# EAGLE design SwiftV1 (EAGLE 6.1)
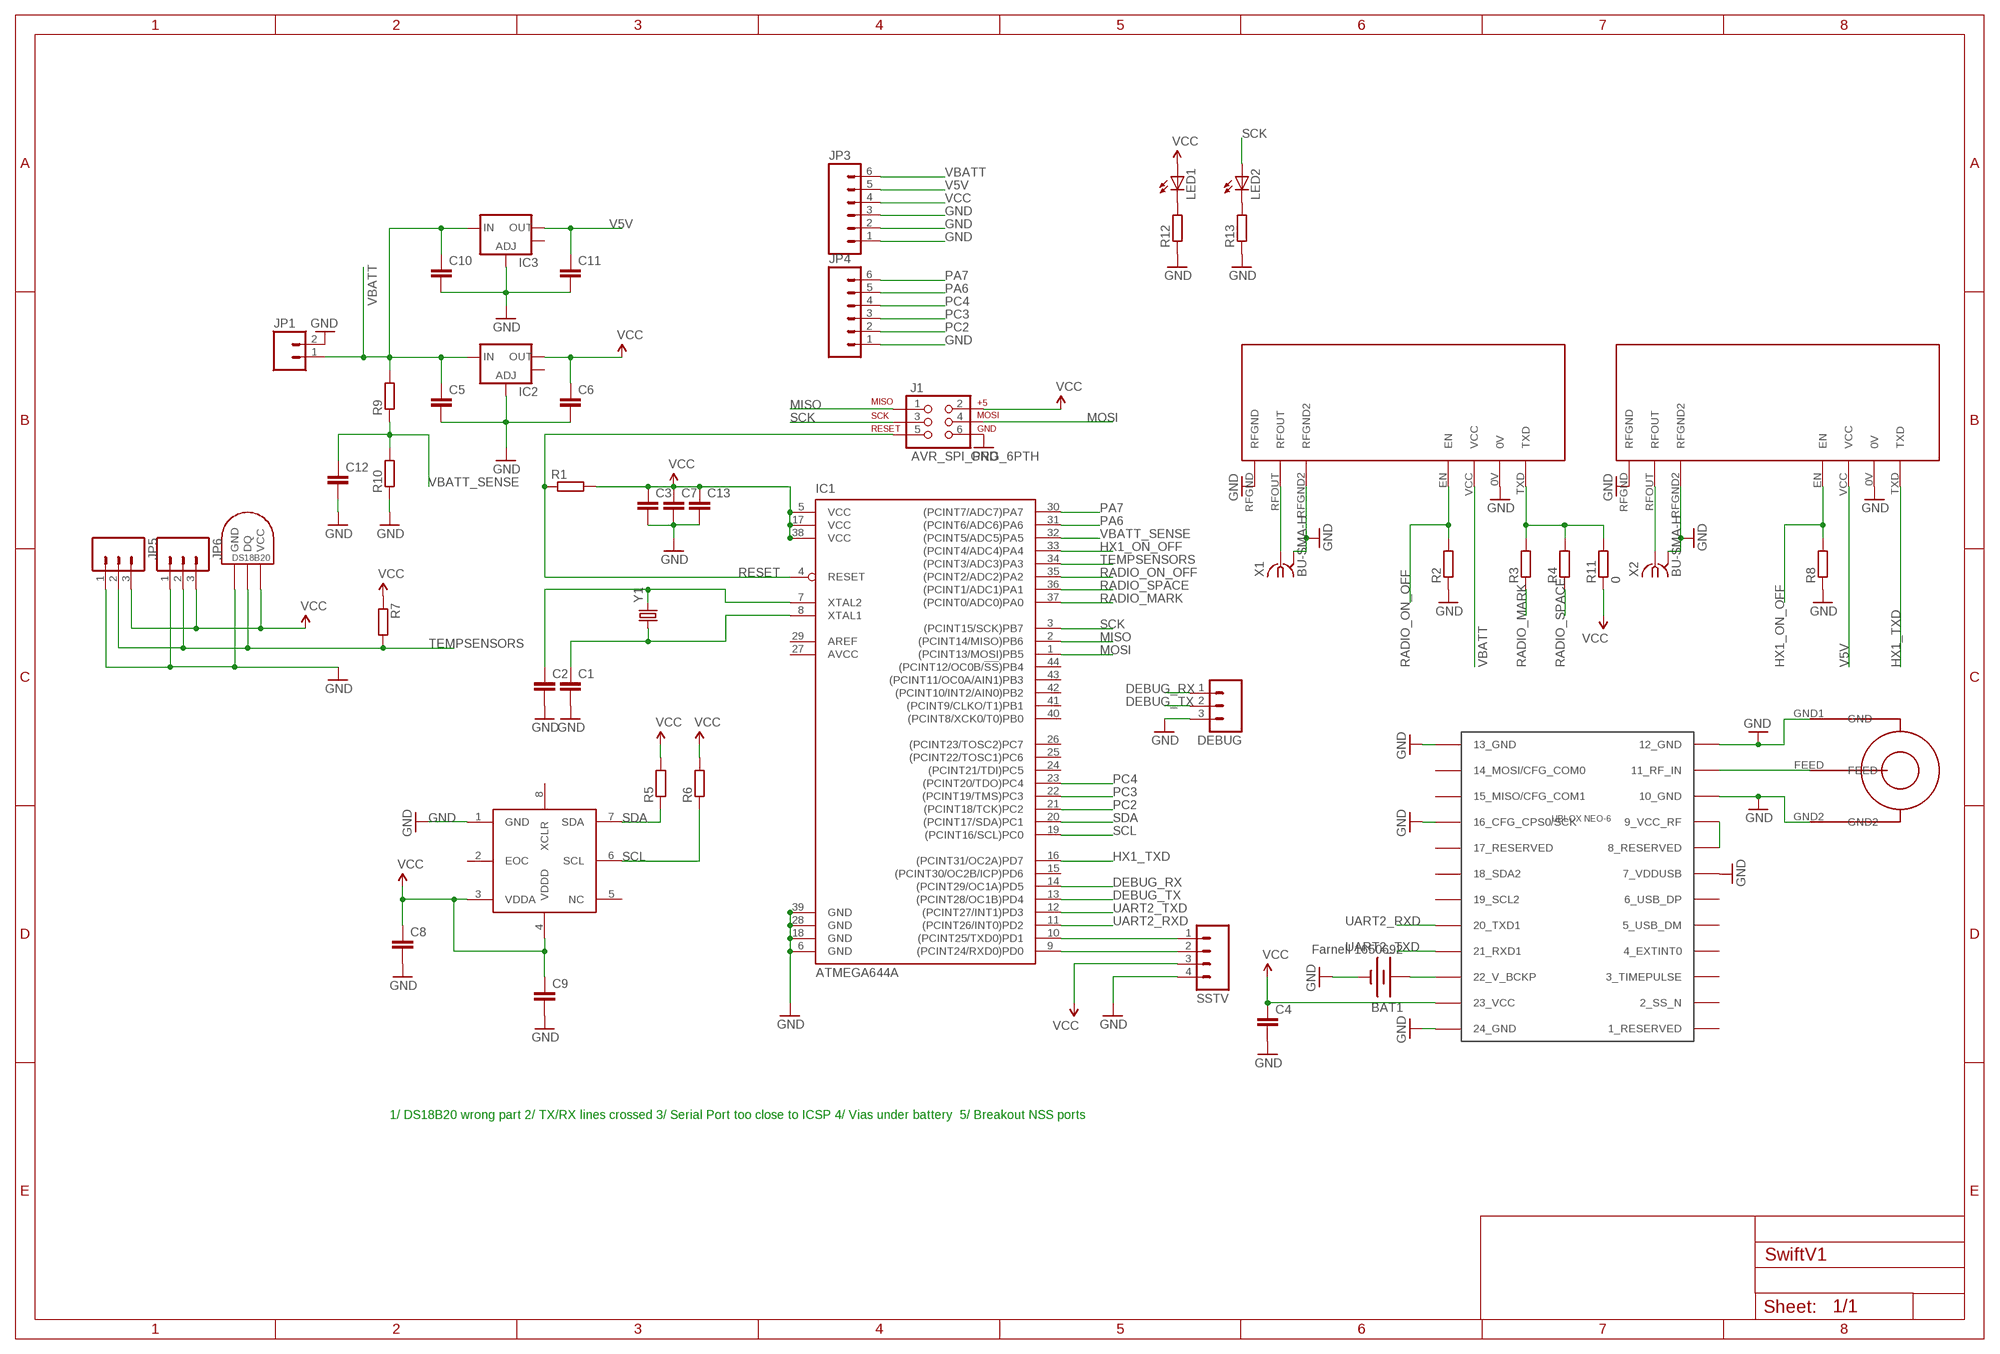
[diagram p0: schematic, sheet 1]

## Parts
BAT1  Farnell 1650692  BATTERY12MM  [BATTCON_12MM]
C1  C-EUC0805  [C0805]
C2  C-EUC0805  [C0805]
C3  C-EUC0805  [C0805]
C4  C-EUC0805  [C0805]
C5  C-EUC0805  [C0805]
C6  C-EUC0805  [C0805]
C7  C-EUC0805  [C0805]
C8  C-EUC0805  [C0805]
C9  C-EUC0805  [C0805]
C10  C-EUC0805  [C0805]
C11  C-EUC0805  [C0805]
C12  C-EUC0805  [C0805]
C13  C-EUC0805  [C0805]
DEBUG  M03PTH  [1X03]
IC1  ATMEGA644A  [TQFP44]
IC2  V_REG_LM1117SOT223  [SOT223]
IC3  V_REG_LM1117SOT223  [SOT223]
J1  AVR_SPI_PRG_6PTH  [2X3]
JP1  M02JST-PTH-2  [JST-2-PTH]
JP3  M06SIP  [1X06]
JP4  M06SIP  [1X06]
JP5  M03JST-PTH  [JST-3-PTH]
JP6  M03JST-PTH  [JST-3-PTH]
LED1  LED0603  [LED-0603]
LED2  LED0603  [LED-0603]
R1  R-EU_R0805  [R0805]
R2  R-EU_R0805  [R0805]
R3  R-EU_R0805  [R0805]
R4  R-EU_R0805  [R0805]
R5  R-EU_R0805  [R0805]
R6  R-EU_R0805  [R0805]
R7  R-EU_R0805  [R0805]
R8  R-EU_R0805  [R0805]
R9  R-EU_R0805  [R0805]
R10  R-EU_R0805  [R0805]
R11  0  R-EU_R0805  [R0805]
R12  R-EU_R0805  [R0805]
R13  R-EU_R0805  [R0805]
SSTV  M04PTH  [1X04]
TEMPINT  DS1821  DS1820SOIC  [DS18B20_SOIC]
U$1  BMP085  [BMP085]
U$2  NTX2  [NTX2]
U$3  SARANTEL-SR1202  [SARANTEL-SR1202]
U$4  UBLOX_NEO-6  [UBLOX_NEO-6P]
U$5  NTX2  [NTX2]
X1  BU-SMA-H  [BU-SMA-H]
X2  BU-SMA-H  [BU-SMA-H]
Y1  CRYSTALSMD  [HC49UP]

## Nets
DEBUG_RX: DEBUG.1 IC1.14((PCINT29/OC1A)PD5)
DEBUG_TX: DEBUG.2 IC1.13((PCINT28/OC1B)PD4)
GND: BAT1.GND(-) C1.2 C2.2 C3.2 C4.2 C5.2 C6.2 C7.2 C8.2 C9.2 C10.2 C11.2 C12.2 C13.2 DEBUG.3 IC1.6(GND) IC1.18(GND) IC1.28(GND) IC1.39(GND) IC2.1(ADJ) IC3.1(ADJ) J1.6 JP1.2 JP3.1 JP3.2 JP3.3 JP4.1 JP5.1 JP6.1 R2.1 R8.1 R10.1 R12.1 R13.1 SSTV.4 TEMPINT.GND U$1.1(GND) U$2.0V U$2.RFGND U$2.RFGND2 U$3.GND1(GND) U$3.GND2 U$4.7_VDDUSB U$4.10_GND U$4.12_GND U$4.13_GND U$4.16_CFG_CPS0/SCK U$4.24_GND U$5.0V U$5.RFGND U$5.RFGND2 X1.2(GND) X2.2(GND)
HX1_ON_OFF: IC1.33((PCINT4/ADC4)PA4) R8.2 U$5.EN
HX1_TXD: IC1.16((PCINT31/OC2A)PD7) U$5.TXD
MISO: IC1.2((PCINT14/MISO)PB6) J1.1
MOSI: IC1.1((PCINT13/MOSI)PB5) J1.4
N$1: C2.1 IC1.7(XTAL2) Y1.2
N$2: C1.1 IC1.8(XTAL1) Y1.1
N$4: U$2.RFOUT X1.1
N$5: BAT1.PWR@1(+) U$4.22_V_BCKP
N$7: LED1.C R12.2
N$8: U$5.RFOUT X2.1
N$9: U$3.FEED U$4.11_RF_IN
N$10: R3.2 R4.2 R11.2 U$2.TXD
N$11: U$4.8_RESERVED U$4.9_VCC_RF
N$14: LED2.C R13.2
PA6: IC1.31((PCINT6/ADC6)PA6) JP4.5
PA7: IC1.30((PCINT7/ADC7)PA7) JP4.6
PC2: IC1.21((PCINT18/TCK)PC2) JP4.2
PC3: IC1.22((PCINT19/TMS)PC3) JP4.3
PC4: IC1.23((PCINT20/TDO)PC4) JP4.4
RADIO_MARK: IC1.37((PCINT0/ADC0)PA0) R3.1
RADIO_ON_OFF: IC1.35((PCINT2/ADC2)PA2) R2.2 U$2.EN
RADIO_SPACE: IC1.36((PCINT1/ADC1)PA1) R4.1
RESET: IC1.4(RESET) J1.5 R1.1
RXD0: IC1.9((PCINT24/RXD0)PD0) SSTV.2
SCK: IC1.3((PCINT15/SCK)PB7) J1.3 LED2.A
SCL: IC1.19((PCINT16/SCL)PC0) R6.1 U$1.6(SCL)
SDA: IC1.20((PCINT17/SDA)PC1) R5.1 U$1.7(SDA)
TEMPSENSORS: IC1.34((PCINT3/ADC3)PA3) JP5.2 JP6.2 R7.2 TEMPINT.DQ
TXD0: IC1.10((PCINT25/TXD0)PD1) SSTV.1
UART2_RXD: IC1.11((PCINT26/INT0)PD2) U$4.20_TXD1
UART2_TXD: IC1.12((PCINT27/INT1)PD3) U$4.21_RXD1
V5V: C11.1 IC3.2(OUT) JP3.5 U$5.VCC
VBATT: C5.1 C10.1 IC2.3(IN) IC3.3(IN) JP1.1 JP3.6 R9.2 U$2.VCC
VBATT_SENSE: C12.1 IC1.32((PCINT5/ADC5)PA5) R9.1 R10.2
VCC: C3.1 C4.1 C6.1 C7.1 C8.1 C9.1 C13.1 IC1.5(VCC) IC1.17(VCC) IC1.38(VCC) IC2.2(OUT) J1.2 JP3.4 JP5.3 JP6.3 LED1.A R1.2 R5.2 R6.2 R7.1 R11.1 SSTV.3 TEMPINT.VCC U$1.3(VDDA) U$1.4(VDDD) U$4.23_VCC
Unconnected: IC1.15((PCINT30/OC2B/ICP)PD6) IC1.24((PCINT21/TDI)PC5) IC1.25((PCINT22/TOSC1)PC6) IC1.26((PCINT23/TOSC2)PC7) IC1.29(AREF) IC1.40((PCINT8/XCK0/T0)PB0) IC1.41((PCINT9/CLKO/T1)PB1) IC1.42((PCINT10/INT2/AIN0)PB2) IC1.43((PCINT11/OC0A/AIN1)PB3) IC1.44((PCINT12/OC0B/!SS!)PB4) IC2.4(OUT) IC3.4(OUT) U$1.2(EOC) U$1.5(NC) U$1.8(XCLR) U$4.1_RESERVED U$4.2_SS_N U$4.3_TIMEPULSE U$4.4_EXTINT0 U$4.5_USB_DM U$4.6_USB_DP U$4.14_MOSI/CFG_COM0 U$4.15_MISO/CFG_COM1 U$4.17_RESERVED U$4.18_SDA2 U$4.19_SCL2

## Notes on the sheet
- 1/ DS18B20 wrong part 2/ TX/RX lines crossed 3/ Serial Port too close to ICSP 4/ Vias under battery  5/ Breakout NSS ports

## Power pins joined to a net without a drawn wire
AVCC: IC1.27(AVCC)
GND: X1.3(GND) X1.4(GND) X1.5(GND) X2.3(GND) X2.4(GND) X2.5(GND)

## Library data of the parts
BAT1 = SparkFun:BATTERY: Battery Holders Various common sizes : AA, AAA, 20mm coin cell and 12mm coin cell.
C1-C13 = resistor:C-EU: CAPACITOR, European symbol
DEBUG JP5 JP6 = SparkFun:M03: Header 3 Standard 3-pin 0.1" header. Use with straight break away headers (SKU : PRT-00116), right angle break away headers (PRT-00553), swiss pins (PRT-00743), machine pins (PRT-00117), and female headers (PRT-00115). Molex polarized connector foot print use with SKU : PRT-08232 with associated crimp pins and housings.
IC1 = atmel:ATMEGA644: 8-bit Microcontroller with 64K Bytes In-System Programmable Flash Source: http://www.atmel.com/dyn/resources/prod_documents/doc2593.pdf; MPN: ATMEGA644PV-10AU; OC_FARNELL: 1455123; OC_NEWARK: 58M3748
IC2 IC3 = SparkFun:V_REG_LM1117: Voltage Regulator LM1117 Standard adjustable voltage regulator but in SMD form. Spark Fun Electronics SKU : COM-00595
J1 = SparkFun:AVR_SPI_PRG_6: AVR ISP 6 Pin This is the reduced ISP connector for AVR programming. Common on Arduino. This footprint will take up less PCB space and can be used with a 10-pin to 6-pin adapter such as SKU: BOB-08508
JP1 = SparkFun:M02: Header 2 Standard 2-pin 0.1" header. Use with straight break away headers (SKU : PRT-00116), right angle break away headers (PRT-00553), swiss pins (PRT-00743), machine pins (PRT-00117), and female headers (PRT-00115). Molex polarized connector foot print use with SKU : PRT-08233 with associated crimp pins and housings.
JP3 JP4 = SparkFun:M06: Header 6 Standard 6-pin 0.1" header. Use with straight break away headers (SKU : PRT-00116), right angle break away headers (PRT-00553), swiss pins (PRT-00743), machine pins (PRT-00117), and female headers (PRT-00115). Molex polarized connector foot print use with SKU : PRT-08094 with associated crimp pins and housings. NOTES ON THE VARIANTS LOCK and LOCK_LONGPADS... This footprint was designed to help hold the alignment of a through-hole component (i.e. 6-pin header) while soldering it into place. You may notice that each hole has been shifted either up or down by 0.005 of an inch from it's more standard position (which is a perfectly straight line). This slight alteration caused the pins (the squares in the middle) to touch the edges of the holes. Because they are alternating, it causes a "brace" to hold the component in place. 0.005 has proven to be the perfect amount of "off-center" position when using our standard breakaway headers. Although looks a little odd when you look at the bare footprint, once you have a header in there, the alteration is very hard to notice. Also, if you push a header all the way into place, it is covered up entirely on the bottom side. This idea of altering the position of holes to aid alignment will be further integrated into the Sparkfun Library for other footprints. It can help hold any component with 3 or more connection pins.
LED1 LED2 = SparkFun:LED: LEDs Standard schematic elements and footprints for 5mm, 3mm, 1206, and 0603 sized LEDs. 5mm - Spark Fun Electronics SKU : COM-00529 (and others)
R1-R13 = resistor:R-EU_: RESISTOR, European symbol
SSTV = SparkFun:M04: Header 4 Standard 4-pin 0.1" header. Use with straight break away headers (SKU : PRT-00116), right angle break away headers (PRT-00553), swiss pins (PRT-00743), machine pins (PRT-00117), and female headers (PRT-00115). Molex polarized connector foot print use with SKU : PRT-08231 with associated crimp pins and housings. 1MM SMD Version SKU: PRT-10208
TEMPINT = ava:DS1820: DS18B20 Programmable Resolution 1-Wire Digital Thermometer Description The DS18B20 digital thermometer provides 9-bit to 12-bit Celsius temperature measurements and has an alarm function with nonvolatile user-programmable upper and lower trigger points. The DS18B20 communicates over a 1-Wire® bus that by definition requires only one data line (and ground) for communication with a central microprocessor. It has an operating temperature range of -55°C to +125°C and is accurate to ±0.5°C over the range of -10°C to +85°C. In addition, the DS18B20 can derive power directly from the data line ("parasite power"), eliminating the need for an external power supply. Each DS18B20 has a unique 64-bit serial code, which allows multiple DS18B20s to function on the same 1-Wire bus. Thus, it is simple to use one microprocessor to control many DS18B20s distributed over a large area. Applications that can benefit from this feature include HVAC environmental controls, temperature monitoring systems inside buildings, equipment, or machinery, and process monitoring and control systems.
U$1 = SparkFun:BMP085
U$2 U$5 = ava:NTX2: Radiometrix NTX2 Transmitter Module Author Anthony Stirk / http://ava.upuaut.net
U$3 = ava:SARANTEL-SR1202: SARANTEL-SL1202 Author Anthony Stirk / http://ava.upuaut.net Data Sheet : http://docs-europe.electrocomponents.com/webdocs/0dbd/0900766b80dbde80.pdf
U$4 = ava:UBLOX_NEO-6: UBLOX NEO-6 GPS MODULE Author Anthony Stirk / http://ava.upuaut.net http://www.u-blox.com/images/downloads/Product_Docs/LEA-6_NEO-6_MAX-6_HardwareIntegrationManual_%28GPS.G6-HW-09007%29.pdf http://www.u-blox.com/images/downloads/Product_Docs/NEO-6_DataSheet_%28GPS.G6-HW-09005%29.pdf
X1 X2 = con-coax:BU-SMA-H: FEMALE SMA CONNECTOR Radiall; OC_FARNELL: unknown; OC_NEWARK: unknown
Y1 = SparkFun:CRYSTAL: Crystals Various standard crystals. Proven footprints. Spark Fun Electronics SKU : COM-00534

## Board
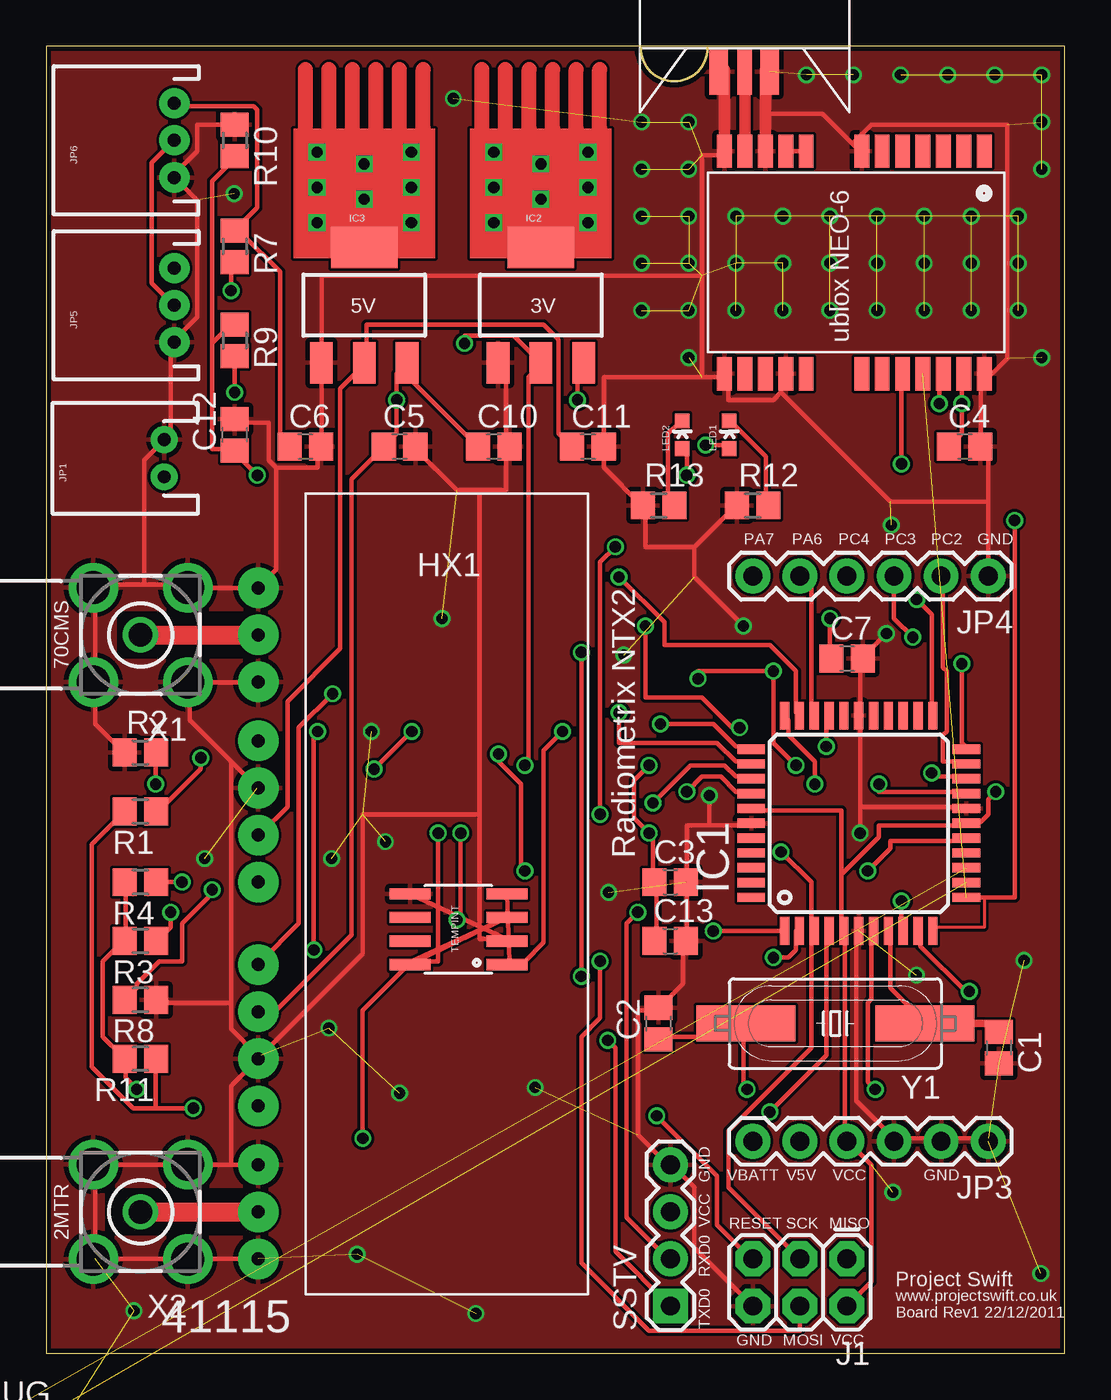
[diagram p1: board, top side]
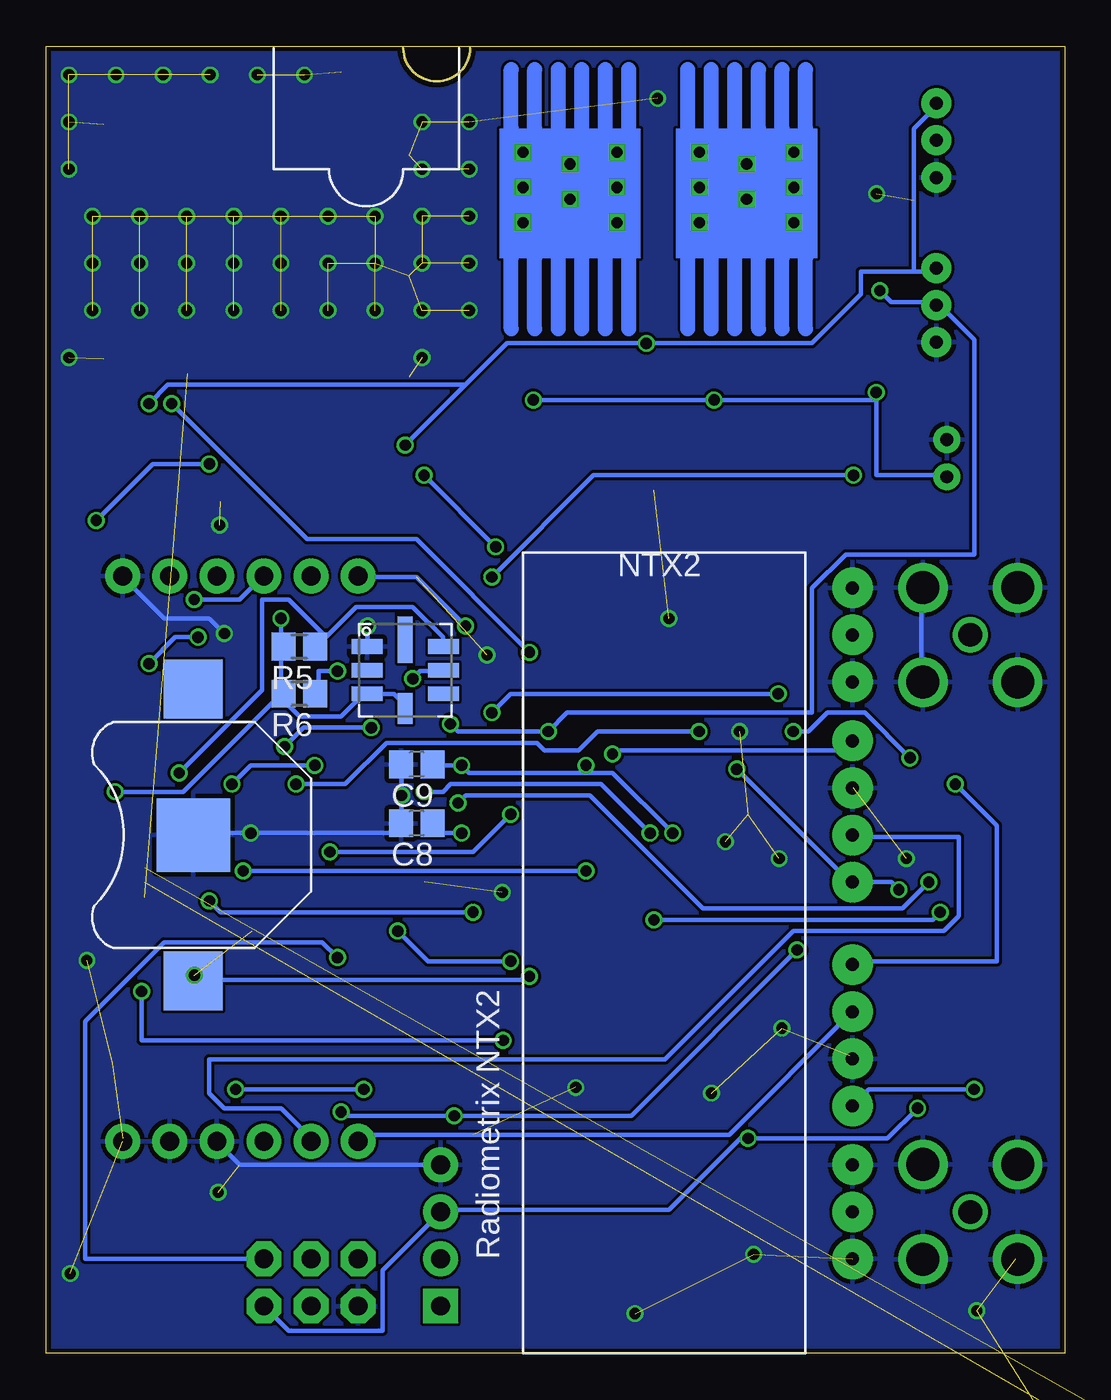
[diagram p2: board, bottom side, seen from below]

Size 54.91 x 70.47 mm. Coordinates in mm from the lower left corner, seen from the top.
Outline: 0,0 54.91,0 54.91,70.47 0,70.47 0,0
Copper layers (1*16): Top 0.035mm / dielectric 1.5mm / Bottom 0.035mm
Design rules: minimum track width 6mil, minimum drill 12mil, track to track 6mil, track to pad 6mil, pad to pad 6mil, via to via 6mil, smd to smd 0mil, copper to edge 10mil, drill to drill 10mil, minimum pad ring 10mil, minimum via ring 6mil, stop-mask expansion 2mil, vias tented up to drill 100mil, thermal gap 10mil
tRestrict: area 3.8,37.5 to 11.4,40; area 3.2,6.3 to 11.4,8.9

### Footprints (pad centres in the part's own frame; a part is rotated, then mirrored left to right if it is on the bottom)
BATTCON_12MM = smd 3.962 x 3.962: GND 0,0 | smd 3.175 x 3.175: PWR@1 -7.874,0; PWR@2 7.874,0
C0805 = smd 1.3 x 1.5: 1 -0.85,0; 2 0.85,0
1X03 = drill 1.016 pad 1.88: 1 0,0; 2 2.54,0; 3 5.08,0
TQFP44 = smd 1.5 x 0.5: 1 -5.8,4; 2 -5.8,3.2; 3 -5.8,2.4; 4 -5.8,1.6; 5 -5.8,0.8; 6 -5.8,0; 7 -5.8,-0.8; 8 -5.8,-1.6; 9 -5.8,-2.4; 10 -5.8,-3.2; 11 -5.8,-4; 23 5.8,-4; 24 5.8,-3.2; 25 5.8,-2.4; 26 5.8,-1.6; 27 5.8,-0.8; 28 5.8,0; 29 5.8,0.8; 30 5.8,1.6; 31 5.8,2.4; 32 5.8,3.2; 33 5.8,4 | smd 0.5 x 1.5: 12 -4,-5.8; 13 -3.2,-5.8; 14 -2.4,-5.8; 15 -1.6,-5.8; 16 -0.8,-5.8; 17 0,-5.8; 18 0.8,-5.8; 19 1.6,-5.8; 20 2.4,-5.8; 21 3.2,-5.8; 22 4,-5.8; 34 4,5.8; 35 3.2,5.8; 36 2.4,5.8; 37 1.6,5.8; 38 0.8,5.8; 39 0,5.8; 40 -0.8,5.8; 41 -1.6,5.8; 42 -2.4,5.8; 43 -3.2,5.8; 44 -4,5.8
SOT223 = smd 1.219 x 2.235: 1 -2.311,-3.099; 2 0,-3.099; 3 2.311,-3.099 | smd 3.6 x 2.2: 4 0,3.099
2X3 = drill 1.016 pad 1.88 octagon: 1 0,0; 2 0,2.54; 3 2.54,0; 4 2.54,2.54; 5 5.08,0; 6 5.08,2.54
JST-2-PTH = drill 0.7 pad 1.448: 1 -1,0; 2 1,0
1X06 = drill 1.016 pad 1.88: 1 0,0; 2 2.54,0; 3 5.08,0; 4 7.62,0; 5 10.16,0; 6 12.7,0
JST-3-PTH = drill 0.7 pad 1.626: 1 -2,-5; 2 0,-5; 3 2,-5
LED-0603 = smd 0.8 x 0.8: A 0,-0.75; C 0,0.75
R0805 = smd 1.3 x 1.5: 1 -0.85,0; 2 0.85,0
1X04 = drill 1.016 pad 1.88 square: 1 0,0 | drill 1.016 pad 1.88: 2 2.54,0; 3 5.08,0; 4 7.62,0
DS18B20_SOIC = smd 0.61 x 2.21: DQ 1.905,-2.616; GND 1.905,2.616; NC -1.905,-2.616; NC2 -0.635,-2.616; NC3 -1.905,2.616; NC4 -0.635,2.616; NC5 0.635,2.616; VCC 0.635,-2.616
BMP085 = smd 1.67 x 0.8: 1 -2.065,1.27; 2 -2.065,0; 3 -2.065,-1.27; 5 2.065,-1.27; 6 2.065,0; 7 2.065,1.27 | smd 0.8 x 1.67: 4 0,-2.065 | smd 0.8 x 2.5: 8 0,1.65
NTX2 = drill 0.7 pad 2.184: 0V -2.54,-10.16; EN -7.62,-10.16; RFGND -22.86,-10.16; RFGND2 -27.94,-10.16; RFOUT -25.4,-10.16; TXD 0,-10.16; VCC -5.08,-10.16
SARANTEL-SR1202 = smd 2.5 x 0.8: FEED 0,0 | smd 2.5 x 1: GND1 0,1.4; GND2 0,-1.35
UBLOX_NEO-6P = smd 1.8 x 0.8: 1_RESERVED 6.4,-7.4; 2_SS_N 6.4,-6.3; 3_TIMEPULSE 6.4,-5.2; 4_EXTINT0 6.4,-4.1; 5_USB_DM 6.4,-3; 6_USB_DP 6.4,-1.9; 7_VDDUSB 6.4,-0.8; 8_RESERVED 6.4,2.2; 9_VCC_RF 6.4,3.3; 10_GND 6.4,4.4; 11_RF_IN 6.4,5.5; 12_GND 6.4,6.6; 13_GND -5.6,6.6; 14_MOSI/CFG_COM0 -5.6,5.5; 15_MISO/CFG_COM1 -5.6,4.4; 16_CFG_CPS0/SCK -5.6,3.3; 17_RESERVED -5.6,2.2; 18_SDA2 -5.6,-0.8; 19_SCL2 -5.6,-1.9; 20_TXD1 -5.6,-3; 21_RXD1 -5.6,-4.1; 22_V_BCKP -5.6,-5.2; 23_VCC -5.6,-6.3; 24_GND -5.6,-7.4
BU-SMA-H = drill 1.27: 1 0,0 | drill 1.778: 2 -2.55,2.55; 3 2.55,2.55; 4 2.55,-2.55; 5 -2.55,-2.55
HC49UP = smd 5.334 x 1.93: 1 -4.826,0; 2 4.826,0

### Placement (x,y rotation side)
BAT1  46.99,27.94 90 bottom
C1  51.37,16.48 270 top
C2  33.02,17.78 90 top
C3  33.66,25.4 0 top
C4  49.53,48.9 0 top
C5  19.05,48.9 0 top
C6  13.97,48.9 0 top
C7  43.18,37.47 0 top
C8  34.92,28.57 180 bottom
C9  34.92,31.75 180 bottom
C10  24.13,48.9 0 top
C11  29.21,48.9 0 top
C12  10.16,49.53 90 top
C13  33.66,22.23 0 top
DEBUG  -4.7,-4.6 0 top  (outside the outline)
IC1  43.81,28.57 90 top
IC2  26.67,56.52 0 top
IC3  17.14,56.52 0 top
J1  43.18,5.08 180 top
JP1  6.35,48.26 90 top
JP3  50.8,11.43 180 top
JP4  50.8,41.91 180 top
JP5  1.91,56.52 90 top
JP6  1.91,65.41 90 top
LED1  36.83,49.53 0 top
LED2  34.29,49.53 0 top
R1  5.08,29.21 180 top
R2  5.08,32.38 0 top
R3  5.08,22.23 180 top
R4  5.08,25.4 180 top
R5  41.27,38.1 180 bottom
R6  41.27,35.56 180 bottom
R7  10.16,59.69 270 top
R8  5.08,19.05 180 top
R9  10.16,54.61 270 top
R10  10.16,65.41 270 top
R11  5.08,15.88 180 top
R12  38.1,45.72 0 top
R13  33.02,45.72 0 top
SSTV  33.66,2.54 90 top
TEMPINT  22.23,22.86 90 top
U$1  35.56,36.83 0 bottom
U$2  21.59,13.34 270 top
U$3  37.66,69.11 90 top
U$4  43.18,58.42 90 top
U$5  21.59,33.02 90 bottom
X1  5.08,38.73 180 top
X2  5.08,7.62 180 top
Y1  42.55,17.78 180 top

### Tracks (layer width: path | path; a pad name or v marks a point on that pad's centre or on a via)
DEBUG_RX  (1 unrouted)
DEBUG_TX  (1 unrouted)
GND  (via drill 0.6, 0.61)  (63 unrouted)
  Top 0.254: 43.89,29.46 49.58,29.46 IC1.18 | 43.89,29.46 43.89,34.34 IC1.28 43.89,34.54 43.89,37.39 C7.2 44.09,37.59 v45.31,38.81 | 43.89,29.46 v43.89,28.04 | JP3.1 50.8,11.58 48.36,11.58 JP3.2 48.16,11.58 45.72,11.58 | 45.72,11.58 43.69,13.61 43.69,22.76 IC1.6 | JP3.3 45.72,11.58 | 34.54,25.4 34.54,22.35 C13.2 34.34,22.15 34.34,19.91 33.12,18.69 C2.2 32.92,18.49 31.9,18.49 31.9,11.79 33.53,10.16 SSTV.4 33.73,10.16 34.95,8.94 34.95,5.69 J1.6 | 35.76,28.45 34.54,28.45 34.54,25.4 | 35.76,28.45 38,28.45 IC1.39 | 34.54,25.4 C3.2 | v35.76,30.07 35.76,28.45 | 34.95,43.48 37.19,45.72 R12.1 | 34.95,43.48 32.31,43.48 32.31,45.72 R13.1 32.11,45.72 30.07,47.75 30.07,48.77 C11.2 30.07,48.97 30.07,52.63 35.36,52.63 | v37.59,39.22 34.95,41.86 34.95,43.48 | 35.36,52.63 36.58,52.63 U$4.13_GND 36.78,52.63 36.78,51.41 39.22,51.41 39.62,51.82 | 39.62,51.82 39.62,52.43 39.83,52.63 U$4.16_CFG_CPS0/SCK | 35.36,58.12 35.36,52.63 | 35.36,58.12 35.36,64.62 36.37,64.62 U$4.12_GND | 43.48,65.23 41.86,66.85 38.78,66.85 | 43.48,65.23 43.89,64.82 U$4.7_VDDUSB | 50.39,52.22 50.39,52.63 U$4.24_GND 50.39,52.22 | 50.39,52.22 50.39,48.97 C4.2 50.39,48.77 50.8,48.36 50.8,45.92 | 50.8,45.92 JP4.1 | 43.48,65.23 44.5,66.24 51.82,66.24 51.82,53.65 50.39,52.22 | 39.62,51.82 45.52,45.92 50.8,45.92 | 23.37,46.53 24.79,46.53 24.79,48.77 C10.2 24.79,48.97 24.79,52.83 24.38,53.24 IC2.1 | 23.37,46.53 22.15,46.53 19.91,48.77 C5.2 | 23.37,29.06 23.37,46.53 | 23.37,29.06 23.37,22.35 24.79,22.35 TEMPINT.GND | U$5.RFGND2 7.72,5.08 X2.2 7.52,5.08 2.64,5.08 | 9.96,18.9 6.1,18.9 R8.1 | 9.96,18.9 9.96,17.48 11.38,16.05 U$2.0V | 9.96,10.16 7.72,10.16 X2.5 7.52,10.16 2.64,10.16
  Top 0.254: 9.96,10.16 U$5.RFGND | 9.96,10.16 9.96,14.43 11.38,15.85 U$2.0V | 2.64,5.08 2.64,10.16 | X2.3 2.64,5.08 | 2.64,10.16 X2.4 | R10.1 8.13,66.24 8.13,64.82 6.91,63.6 JP6.1 6.91,63.4 8.13,62.18 8.13,55.88 6.91,54.66 JP5.1 6.71,54.46 6.71,49.58 6.5,49.38 JP1.2 6.3,49.17 5.28,48.16 5.28,41.45 | 9.96,31.9 7.72,34.14 7.72,36.17 | 9.96,31.9 11.38,30.48 U$5.0V | 7.72,36.17 11.38,36.17 U$2.RFGND | 7.72,36.17 X1.2 | R2.1 4.06,32.51 2.64,33.93 2.64,36.17 X1.3 2.64,36.37 2.64,41.25 X1.4 2.64,41.45 5.28,41.45 | 12.39,47.75 11.99,48.16 11.99,50.19 10.16,50.19 C12.2 | 12.39,47.75 14.63,47.75 14.63,48.77 C6.2 14.83,48.97 IC3.1 14.83,58.12 35.36,58.12 | 12.39,47.75 12.39,42.27 11.58,41.45 U$2.RFGND2 11.38,41.25 7.72,41.25 X1.5 7.52,41.45 5.28,41.45 | 9.96,18.9 9.96,31.9 | 23.37,29.06 17.07,29.06 17.07,21.54 11.58,16.05 U$2.0V
  Top 0.406: 38.78,69.22 U$3.GND2 | 36.58,69.22 U$3.GND1
  Top 0.61: U$4.10_GND 38.78,66.85 38.78,69.22 | U$4.12_GND 36.58,69.22
  Bottom 0.254: C9.2 35.76,31.7 v35.76,30.07 35.76,28.65 C8.2 35.97,28.45 36.37,28.04 v43.89,28.04 46.94,28.04 BAT1.GND | JP3.3 45.72,11.38 44.5,10.16 SSTV.4 | v37.59,39.22 37.59,38.2 U$1.1 | X1.2 7.72,36.37 7.72,41.25 X1.5 | v45.31,38.81 46.13,39.62 48.56,39.62 50.8,41.86 JP4.1
  other vias: 21.95,67.67 18.29,27.58 15.39,26.67 15.24,17.53 19.05,14.02 26.37,14.33 30.33,24.84 21.34,39.62 45.57,44.65 52.73,21.18 53.63,4.3 45.65,8.67 4.72,2.29 16.76,5.33 23.16,2.13 8.53,26.67 17.53,33.53 37.19,56.24 37.19,58.78 37.19,61.32 39.73,61.32 39.73,58.78 39.73,56.24 42.27,56.24 42.27,58.78 42.27,61.32 44.81,61.32 44.81,58.78 44.81,56.24 47.35,56.24 47.35,58.78 47.35,61.32 49.89,61.32 49.89,58.78 49.89,56.24 41,68.94 43.54,68.94 46.08,68.94 48.62,68.94 51.16,68.94 34.65,61.32 34.65,63.86 34.65,66.4 32.11,66.4 32.11,63.86 32.11,61.32 32.11,58.78 34.65,58.78 34.65,56.24 32.11,56.24 34.65,53.7 53.7,68.94 52.43,61.32 52.43,58.78 52.43,56.24 53.7,66.4 53.7,63.86 53.7,53.7 31.15,37.65 10.14,62.52 46.93,20.38
  pour Bottom: 0,70.48 54.61,70.48 54.61,0 0,0
  pour Top: 0,70.48 54.61,70.48 54.61,0 0,0
HX1_ON_OFF  (via drill 0.61)
  Top 0.254: v8.94,24.99 8.94,24.79 7.32,23.16 7.32,21.13 6.1,21.13 4.88,19.91 4.88,19.71 4.27,19.1 R8.2 | v41.45,30.68 41.45,31.9 40.03,33.33 40.03,34.14 39.83,34.34 IC1.33 | v17.68,31.5 v19.71,33.53
  Bottom 0.254: v8.94,24.99 9.35,25.4 U$5.EN 11.58,25.4 v17.68,31.5 | v41.45,30.68 38.81,30.68 36.58,32.92 28.45,32.92 28.04,32.51 26.21,32.51 25.2,33.53 v19.71,33.53
HX1_TXD  (via drill 0.61)
  Top 0.254: v44.3,26.01 45.52,27.23 45.52,27.64 49.58,27.64 IC1.16 | v25.81,26.01 25.6,26.21 25.6,30.68 24.38,31.9 v24.38,32.31
  Bottom 0.254: v25.81,26.01 v44.3,26.01 | v24.38,32.31 24.18,32.51 11.99,32.51 11.58,32.92 U$5.TXD
MISO  (via drill 0.61)
  Top 0.254: v39.22,21.34 40.03,21.34 40.44,21.74 40.44,22.76 IC1.2
  Bottom 0.254: v39.22,21.34 40.03,22.15 48.56,22.15 52.83,17.88 52.83,5.08 J1.1
MOSI  (via drill 0.61)
  Top 0.254: v35.97,22.76 39.62,22.76 IC1.1 | v29.87,21.13 29.87,18.09 28.85,17.07 28.85,4.88 32.51,1.22 40.64,1.22 J1.4
  Bottom 0.254: v35.97,22.76 34.34,21.13 v29.87,21.13
N$1  (via drill 0.61)
  Top 0.254: 37.59,17.07 33.12,17.07 C2.1 | 37.59,17.07 37.59,17.68 Y1.2 37.59,17.07 | v44.7,14.22 44.3,14.63 44.3,18.9 44.5,19.1 44.5,22.76 IC1.7 | v37.8,14.22 37.59,14.43 37.59,17.07
  Bottom 0.254: v37.8,14.22 v44.7,14.22
N$2
  Top 0.254: IC1.8 45.52,22.76 45.52,19.71 47.35,17.88 Y1.1
  Top 0.406: Y1.1 51.37,17.78 C1.1
N$4
  Top 1.016: X1.1 U$2.RFOUT
N$5  (via drill 0.61)
  Top 0.254: v48.16,51.21 48.16,52.43 48.36,52.63 U$4.22_V_BCKP | v28.85,20.32 v28.85,37.8
  Bottom 0.254: v48.16,51.21 40.84,43.89 34.95,43.89 v28.85,37.8 | v28.85,20.32 29.06,20.12 46.94,20.12 BAT1.PWR@1
N$7
  Top 0.254: LED1.C 36.98,50.19 38.81,48.36 38.81,45.72 R12.2
N$8
  Top 1.016: X2.1 U$5.RFOUT
N$9
  Top 0.406: U$4.11_RF_IN 37.66,64.82
  Top 0.61: 37.66,64.82 U$3.FEED
N$10  (via drill 0.61)
  Top 0.254: R4.2 4.27,25.4 4.27,22.35 R3.2 4.06,22.15 3.05,21.13 3.05,17.07 4.06,16.05 R11.2 4.27,15.85 4.27,14.83 v4.88,14.22
  Bottom 0.254: v4.88,14.22 10.57,14.22 11.38,13.41 U$2.TXD
N$11
  Top 0.254: U$4.9_VCC_RF 40.03,64.82 40.84,64.82 U$4.8_RESERVED
N$14
  Top 0.254: LED2.C 34.14,50.19 33.53,49.58 33.53,45.92 33.73,45.72 R13.2
N$15
  Top 0.813: 13.97,65.41 13.97,69.22
N$16
  Top 0.813: 15.24,65.41 15.24,69.22
N$17
  Top 0.813: 16.51,65.41 16.51,69.22
N$18
  Top 0.813: 17.78,66.04 17.78,69.22
N$19
  Top 0.813: 19.05,66.04 19.05,69.22
N$20
  Top 0.813: 20.32,66.04 20.32,69.22
N$21
  Top 0.813: 23.5,66.04 23.5,69.22
N$22
  Top 0.813: 24.77,66.04 24.77,69.22
N$23
  Top 0.813: 26.04,66.04 26.04,69.22
N$24
  Top 0.813: 27.3,66.04 27.3,69.22
N$25
  Top 0.813: 28.57,66.04 28.57,69.22
N$26
  Top 0.813: 29.84,66.04 29.84,69.22
N$27
  Bottom 0.813: 13.97,66.04 13.97,69.22
N$28
  Bottom 0.813: 15.24,66.04 15.24,69.22
N$29
  Bottom 0.813: 16.51,66.04 16.51,69.22
N$30
  Bottom 0.813: 17.78,66.04 17.78,69.22
N$31
  Bottom 0.813: 19.05,66.04 19.05,69.22
N$32
  Bottom 0.813: 20.32,66.04 20.32,69.22
N$33
  Bottom 0.813: 23.5,66.04 23.5,69.22
N$34
  Bottom 0.813: 24.77,66.04 24.77,69.22
N$35
  Bottom 0.813: 26.04,66.04 26.04,69.22
N$36
  Bottom 0.813: 27.3,66.04 27.3,69.22
N$37
  Bottom 0.813: 28.57,66.04 28.57,69.22
N$38
  Bottom 0.813: 29.84,66.04 29.84,69.22
N$39
  Bottom 0.813: 13.97,55.24 13.97,59.05
N$40
  Bottom 0.813: 15.24,55.24 15.24,59.05
N$41
  Bottom 0.813: 16.51,55.24 16.51,59.05
N$42
  Bottom 0.813: 17.78,55.24 17.78,59.05
N$43
  Bottom 0.813: 19.05,55.24 19.05,59.05
N$44
  Bottom 0.813: 20.32,55.24 20.32,59.05
N$45
  Bottom 0.813: 23.5,55.24 23.5,59.05
N$46
  Bottom 0.813: 24.77,55.24 24.77,59.05
N$47
  Bottom 0.813: 26.04,55.24 26.04,59.05
N$48
  Bottom 0.813: 27.3,55.24 27.3,59.05
N$49
  Bottom 0.813: 28.57,55.24 28.57,59.05
N$50
  Bottom 0.813: 29.84,55.24 29.84,59.05
N$51  (via drill 0.6)
  other vias: 14.61,60.96
N$52  (via drill 0.6)
  other vias: 19.68,60.96
N$53  (via drill 0.6)
  other vias: 14.61,64.77
N$54  (via drill 0.6)
  other vias: 19.68,64.77
N$55  (via drill 0.6)
  other vias: 19.68,62.87
N$56  (via drill 0.6)
  other vias: 14.61,62.87
N$57  (via drill 0.6)
  other vias: 17.14,62.23
N$58  (via drill 0.6)
  other vias: 17.14,64.14
N$59  (via drill 0.6)
  other vias: 24.13,64.77
N$60  (via drill 0.6)
  other vias: 24.13,62.87
N$61  (via drill 0.6)
  other vias: 24.13,60.96
N$62  (via drill 0.6)
  other vias: 29.21,60.96
N$63  (via drill 0.6)
  other vias: 29.21,62.87
N$64  (via drill 0.6)
  other vias: 29.21,64.77
N$65  (via drill 0.6)
  other vias: 26.67,64.14
N$66  (via drill 0.6)
  other vias: 26.67,62.23
PA6
  Top 0.254: IC1.31 41.25,34.54 41.25,41.25 40.64,41.86 JP4.5
PA7  (via drill 0.61)
  Top 0.254: v42.06,32.72 42.06,34.34 IC1.30 | v37.39,33.73 36.98,33.73 35.36,35.36 32.31,35.36 v32.31,39.22
  Bottom 0.254: v42.06,32.72 41.05,33.73 v37.39,33.73 | v32.31,39.22 34.95,41.86 38,41.86 JP4.6
PC2
  Top 0.254: IC1.21 49.58,31.9 48.36,31.9 48.36,33.33 48.56,33.53 48.56,36.78 48.36,36.98 48.36,41.86 JP4.2
PC3  (via drill 0.61)
  Top 0.254: v49.38,37.19 49.38,32.92 49.58,32.72 IC1.22 | v46.74,38.61 45.72,39.62 JP4.3
  Bottom 0.254: v49.38,37.19 47.95,38.61 v46.74,38.61
PC4  (via drill 0.61)
  Top 0.254: v46.94,40.64 47.75,39.83 47.75,34.54 IC1.23
  Bottom 0.254: v46.94,40.64 44.5,40.64 43.28,41.86 JP4.4
RADIO_MARK  (via drill 0.61)
  Top 0.254: v6.71,23.77 6.71,22.96 6.1,22.35 R3.1 | v22.15,23.37 22.35,23.57 v22.35,28.04 | v34.54,30.28 35.36,31.09 36.37,31.09 37.19,30.28 38,30.28 IC1.37
  Bottom 0.254: v6.71,23.77 7.11,23.37 v22.15,23.37 | v22.35,28.04 24.99,30.68 33.12,30.68 33.53,30.28 v34.54,30.28
RADIO_ON_OFF  (via drill 0.61)
  Top 0.254: v5.89,30.68 5.89,32.31 R2.2 | v30.89,34.54 30.89,32.92 36.17,32.92 37.19,31.9 38,31.9 IC1.35 | v15.44,35.56 13.61,33.73 13.61,23.16 11.58,21.13 U$2.EN
  Bottom 0.254: v5.89,30.68 3.66,28.45 3.66,21.13 11.38,21.13 U$2.EN | v30.89,34.54 29.87,35.56 v15.44,35.56
RADIO_SPACE  (via drill 0.61)
  Top 0.254: v32.72,29.67 34.75,31.7 36.58,31.7 37.19,31.09 38,31.09 IC1.36 | R4.1 v7.32,25.4
  Bottom 0.254: v7.32,25.4 8.74,23.98 19.51,23.98 25.6,30.07 32.31,30.07 v32.72,29.67
RESET  (via drill 0.61)
  Top 0.254: v8.33,32.11 8.33,31.5 6.1,29.26 R1.1 | v14.63,33.53 14.43,33.33 v14.43,21.74 | v32.92,12.8 36.17,9.55 36.17,6.91 38,5.08 J1.5 | v39.01,13.01 42.06,16.05 42.06,22.76 IC1.4
  Bottom 0.254: v8.33,32.11 10.77,34.54 12.8,34.54 13.82,33.53 v14.63,33.53 | v14.43,21.74 23.37,12.8 v32.92,12.8 38.81,12.8 v39.01,13.01
RXD0  (via drill 0.61)
  Top 0.254: v46.13,24.38 46.13,22.96 IC1.9 | v31.9,23.77 31.29,23.16 31.29,7.32 33.53,5.08 SSTV.2
  Bottom 0.254: v46.13,24.38 45.52,23.77 v31.9,23.77
SCK  (via drill 0.61)
  Top 0.254: v34.54,47.35 34.54,48.56 34.34,48.77 LED2.A | v30.68,43.48 29.87,42.67 v29.87,29.06 | v39.62,27.03 41.25,25.4 41.25,22.96 IC1.3 41.25,22.76 41.25,16.46 36.78,11.99 36.78,8.94 J1.3
  Bottom 0.254: v30.68,43.48 v34.54,47.35 | v29.87,29.06 31.9,27.03 v39.62,27.03
SCL  (via drill 0.61)
  Top 0.254: v35.15,36.37 35.15,36.78 v39.22,36.78 39.22,32.92 v40.44,31.7 | v44.91,30.68 44.91,30.28 49.58,30.28 IC1.19
  Bottom 0.254: v39.22,36.78 40.23,36.78 40.23,35.56 R6.1 | v35.15,36.37 34.75,36.78 33.53,36.78 U$1.6 | v44.91,30.68 43.89,31.7 v40.44,31.7
SDA  (via drill 0.61)
  Top 0.254: v47.75,31.29 47.75,31.09 49.58,31.09 IC1.20
  Bottom 0.254: 39.83,38.61 38.2,40.23 35.15,40.23 33.53,38.61 33.53,38.2 U$1.7 | 39.83,38.61 40.23,38.2 R5.1 39.83,38.61 | v47.75,31.29 43.28,35.76 43.28,40.64 41.86,40.64 39.83,38.61
TEMPSENSORS  (via drill 0.61)
  Top 0.254: v9.96,57.3 9.96,58.52 10.16,58.73 R7.2 | JP6.2 6.71,65.23 5.69,64.21 5.69,57.71 6.71,56.69 JP5.2 | v33.12,33.93 35.97,33.93 37.19,32.72 38,32.72 IC1.34 | v27.84,33.53 26.82,32.51 26.82,22.15 25.81,21.13 24.99,21.13 TEMPINT.DQ
  Bottom 0.254: v9.96,57.3 9.35,56.69 6.91,56.69 JP5.2 6.71,56.49 4.88,54.66 4.88,43.08 11.79,43.08 13.61,41.25 13.61,34.54 26.82,34.54 v27.84,33.53 32.72,33.53 v33.12,33.93
TXD0  (via drill 0.61)
  Top 0.254: v49.78,19.51 49.58,19.51 47.14,21.95 47.14,22.76 IC1.10 | v30.28,16.87 30.68,16.46 30.68,5.49 33.53,2.64 SSTV.1
  Bottom 0.254: v49.78,19.51 49.78,16.87 v30.28,16.87
UART2_RXD  (via drill 0.61)
  Top 0.152: 50.6,24.59 50.6,22.96 47.95,22.96 IC1.11
  Top 0.254: 49.78,24.59 50.6,24.59 52.22,24.59 v52.22,44.91 | v46.13,47.95 46.13,52.63 U$4.20_TXD1
  Bottom 0.254: v52.22,44.91 49.17,47.95 v46.13,47.95
UART2_TXD  (1 unrouted)
V5V
  Top 0.254: C11.1 28.25,48.97 27.64,49.58 27.64,54.66 26.82,55.47 17.27,55.47 17.27,53.44 IC3.2 17.07,53.24 15.85,52.02 15.85,38 13.01,35.15 13.01,29.46 11.58,28.04 U$5.VCC
  Bottom 0.254: JP3.5 40.64,11.58 42.27,13.21 45.31,13.21 46.13,14.02 46.13,15.85 21.54,15.85 14.63,22.76 6.5,22.76 5.69,23.57 5.69,27.84 11.38,27.84 U$5.VCC
VBATT  (via drill 0.61)
  Top 0.254: 19.1,53.03 19.3,53.24 IC3.3 19.1,53.03 | 19.1,53.03 18.9,52.83 v18.9,51.41 18.9,49.58 18.29,48.97 C5.1 18.09,48.77 16.46,47.14 16.46,22.55 12.39,18.49 11.58,18.49 U$2.VCC | 19.1,53.03 23.16,48.97 C10.1 | v10.16,51.82 R9.2 | v28.65,51.41 28.65,53.03 28.85,53.24 IC2.3
  Bottom 0.254: 10.16,51.41 10.16,47.35 6.5,47.35 JP1.1 | 10.16,51.41 v18.9,51.41 v28.65,51.41 | 10.16,51.41 v10.16,51.82 | JP3.6 38,11.58 37.8,11.79 18.09,11.79 11.58,18.29 U$2.VCC
VBATT_SENSE  (via drill 0.61)
  Top 0.254: 8.94,54.46 8.94,48.77 10.16,48.77 C12.1 10.16,48.56 v11.38,47.35 | 8.94,54.46 9.75,55.27 10.16,55.27 R9.1 | 8.94,54.46 8.94,63.2 10.16,64.41 R10.2 | v30.89,41.86 33.33,39.42 33.33,38.2 39.01,38.2 40.44,36.78 40.44,34.54 IC1.32
  Bottom 0.254: v30.89,41.86 25.4,47.35 v11.38,47.35
VCC  (via drill 0.61)
  Top 0.254: C6.1 13.01,48.97 12.6,49.38 12.6,58.32 10.57,60.35 10.16,60.35 R7.1 10.16,60.55 11.38,61.77 11.38,67.06 11.18,67.26 6.91,67.26 JP6.3 | C4.1 48.77,48.97 49.38,49.58 v49.38,51.21 49.38,52.63 U$4.23_VCC | v35.56,48.97 36.78,48.97 LED1.A | v22.55,54.46 22.55,54.86 25.2,54.86 26.62,53.44 IC2.2 26.62,53.24 26.01,52.63 26.01,31.9 v25.81,31.7 | C13.1 32.92,22.35 32.92,25.4 C3.1 32.72,25.4 32.72,27.84 v32.51,28.04 31.7,28.85 31.7,30.89 v32.51,31.7 | v21.13,28.04 21.13,21.13 19.71,21.13 TEMPINT.VCC 19.51,20.93 17.07,18.49 v17.07,11.58 | 5.89,13.21 4.67,13.21 2.44,15.44 2.44,27.43 4.06,29.06 R1.2 | 5.89,13.21 5.89,15.85 R11.1 | v42.27,39.62 42.27,37.59 C7.1 | 42.88,25.81 42.88,22.96 IC1.5 43.08,22.76 43.08,11.58 JP3.4 43.28,11.38 44.5,10.16 44.5,3.86 J1.2 | 42.88,25.81 42.88,29.26 38.2,29.26 IC1.38 | 42.88,25.81 44.91,27.84 44.91,28.45 49.58,28.45 IC1.17 49.78,28.65 50.39,28.65 50.8,29.06 50.8,29.87 v51.21,30.28 | 5.89,13.21 v7.92,13.21
  Bottom 0.254: 32.31,52.22 30.07,54.46 v22.55,54.46 13.61,54.46 10.97,57.1 10.97,58.32 8.13,58.32 | 32.31,52.22 v35.56,48.97 | 8.13,58.32 6.91,58.32 JP5.3 | v49.38,51.21 48.36,52.22 32.31,52.22 | 8.13,58.32 8.13,66.04 6.91,67.26 JP6.3 | v32.51,28.04 33.53,28.04 33.93,28.45 C8.1 | C9.1 33.93,31.7 v32.51,31.7 32.11,31.29 25.81,31.29 | v21.13,28.04 24.38,31.29 25.81,31.29 | U$1.4 35.56,34.95 36.17,35.56 U$1.3 37.8,35.56 39.01,34.34 41.25,34.34 42.06,35.15 42.06,35.56 R6.2 42.27,35.56 | 42.27,35.56 42.27,38 R5.2 42.27,38.2 v42.27,39.62 | J1.2 41.86,1.22 36.78,1.22 36.78,4.47 33.73,7.52 SSTV.3 33.53,7.72 21.34,7.72 17.48,11.58 v17.07,11.58 9.55,11.58 v7.92,13.21 | 42.27,35.56 47.55,30.28 v51.21,30.28 | 25.81,31.29 v25.81,31.7
(copper drawn outside any net)
  shapes: Bottom area x2, Top area x2

### Text on the board
tNames: 5V | 3V | PA7 | PA6 | PC4 | PC3 | PC2 | GND | HX1 | 70CMS | GND | VBATT | V5V | VCC | GND | VCC | RESET | SCK | MISO | 2MTR | RXD0 | Project Swift | www.projectswift.co.uk | Board Rev1 22/12/2011 | 41115 | TXD0 | GND | MOSI | VCC
bNames: NTX2